# Altium schematic sheet 07_PS_ETH_RJ45.SchDoc
size A4
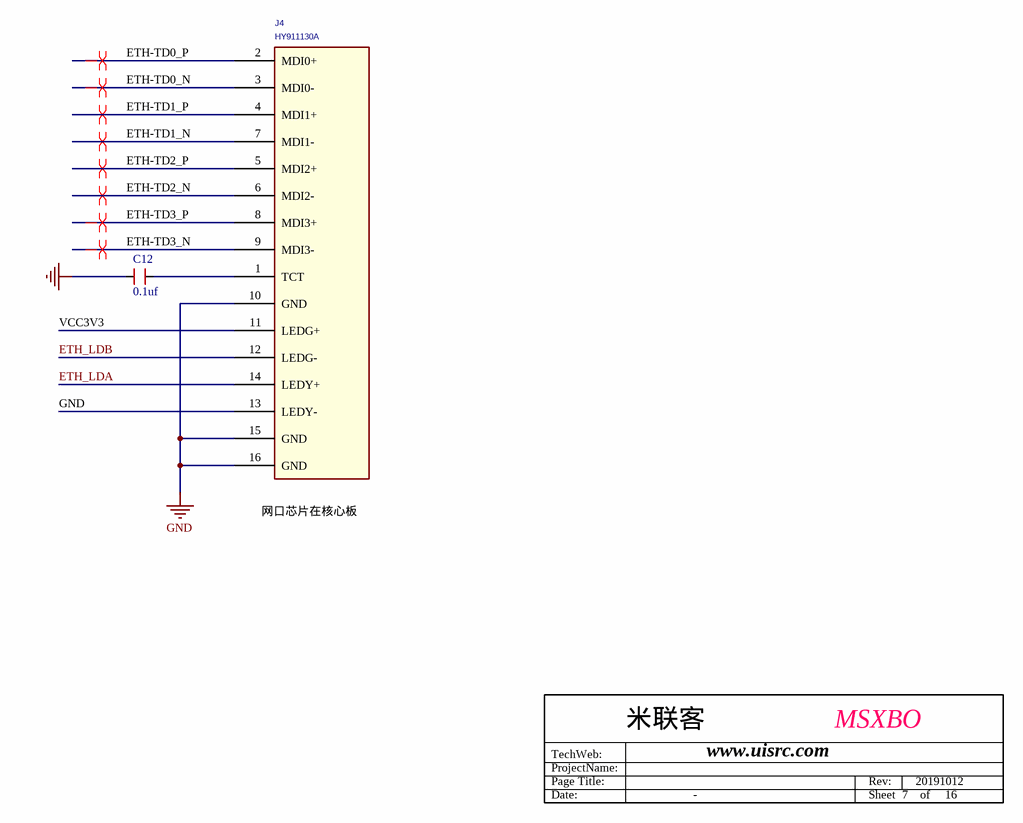
[diagram p0: 07_PS_ETH_RJ45.SchDoc]

## Parts
C12  0.1uf  [CAP0603]
J4  HY911130A  [HY911130A]

## Nets
GND: C12.1 J4.10(GND) J4.13(LEDY-) J4.15(GND) J4.16(GND)
ETH-TD0_N: J4.3(MDI0-)
ETH-TD0_P: J4.2(MDI0+)
ETH-TD1_N: J4.7(MDI1-)
ETH-TD1_P: J4.4(MDI1+)
ETH-TD2_N: J4.6(MDI2-)
ETH-TD2_P: J4.5(MDI2+)
ETH-TD3_N: J4.9(MDI3-)
ETH-TD3_P: J4.8(MDI3+)
ETH_LDA: J4.14(LEDY+)
ETH_LDB: J4.12(LEDG-)
VCC3V3: J4.11(LEDG+)
NetC12_2: C12.2 J4.1(TCT)

## Layout directives
differential pair: ETH-TD0_N, ETH-TD0_P, ETH-TD1_N, ETH-TD1_P, ETH-TD2_N, ETH-TD2_P, ETH-TD3_N, ETH-TD3_P

## Notes on the sheet
- (near J4) 网口芯片在核心板
- ProjectName:
- TechWeb:
- Page Title:
- 米联客
- www.uisrc.com
- MSXBO
- Rev:
- 20191012
- Date:
- -
- Sheet
- 7    of     16

## Library data of the parts
C12 = CAPACITOR: Generic Capacitor; DPN: *; Manufacturer: *